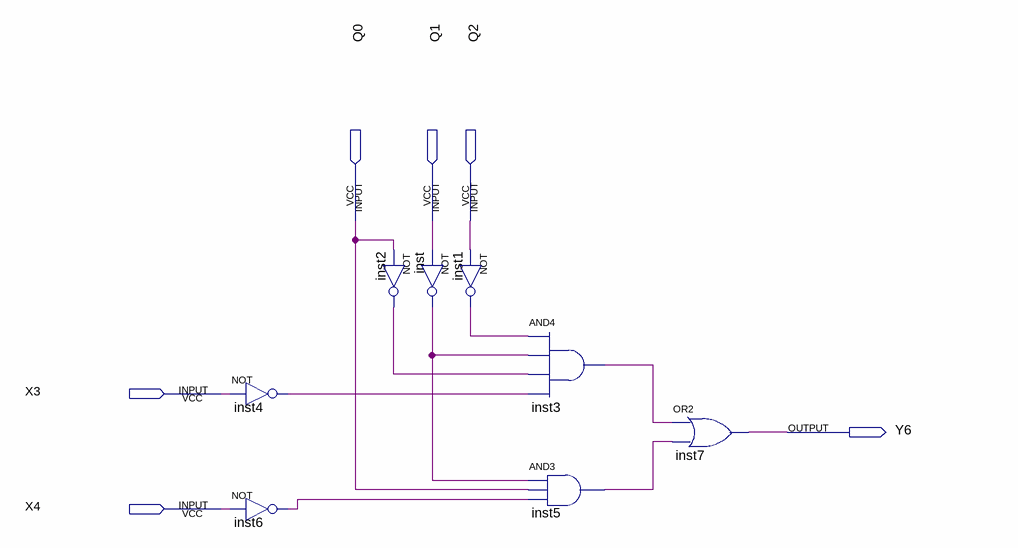
[diagram p0: schematic sheet]
// Quartus schematic Y6.bdf as structural Verilog: 8 symbols, 6 pins
module Y6 (
  input  Q0,
  input  Q1,
  input  Q2,
  input  X3,
  input  X4,
  output Y6
);

  wire inst1_out, inst2_out, inst3_out, inst4_out, inst5_out, inst6_out, inst_out;

  not inst4 (inst4_out, X3);
  not inst6 (inst6_out, X4);
  not inst (inst_out, Q1);
  not inst2 (inst2_out, Q0);
  not inst1 (inst1_out, Q2);
  and inst3 (inst3_out, inst1_out, inst_out, inst2_out, inst4_out);
  and inst5 (inst5_out, inst_out, Q0, inst6_out);
  or inst7 (Y6, inst3_out, inst5_out);
endmodule
